# EAGLE design SNES USB-C (EAGLE 6.2)
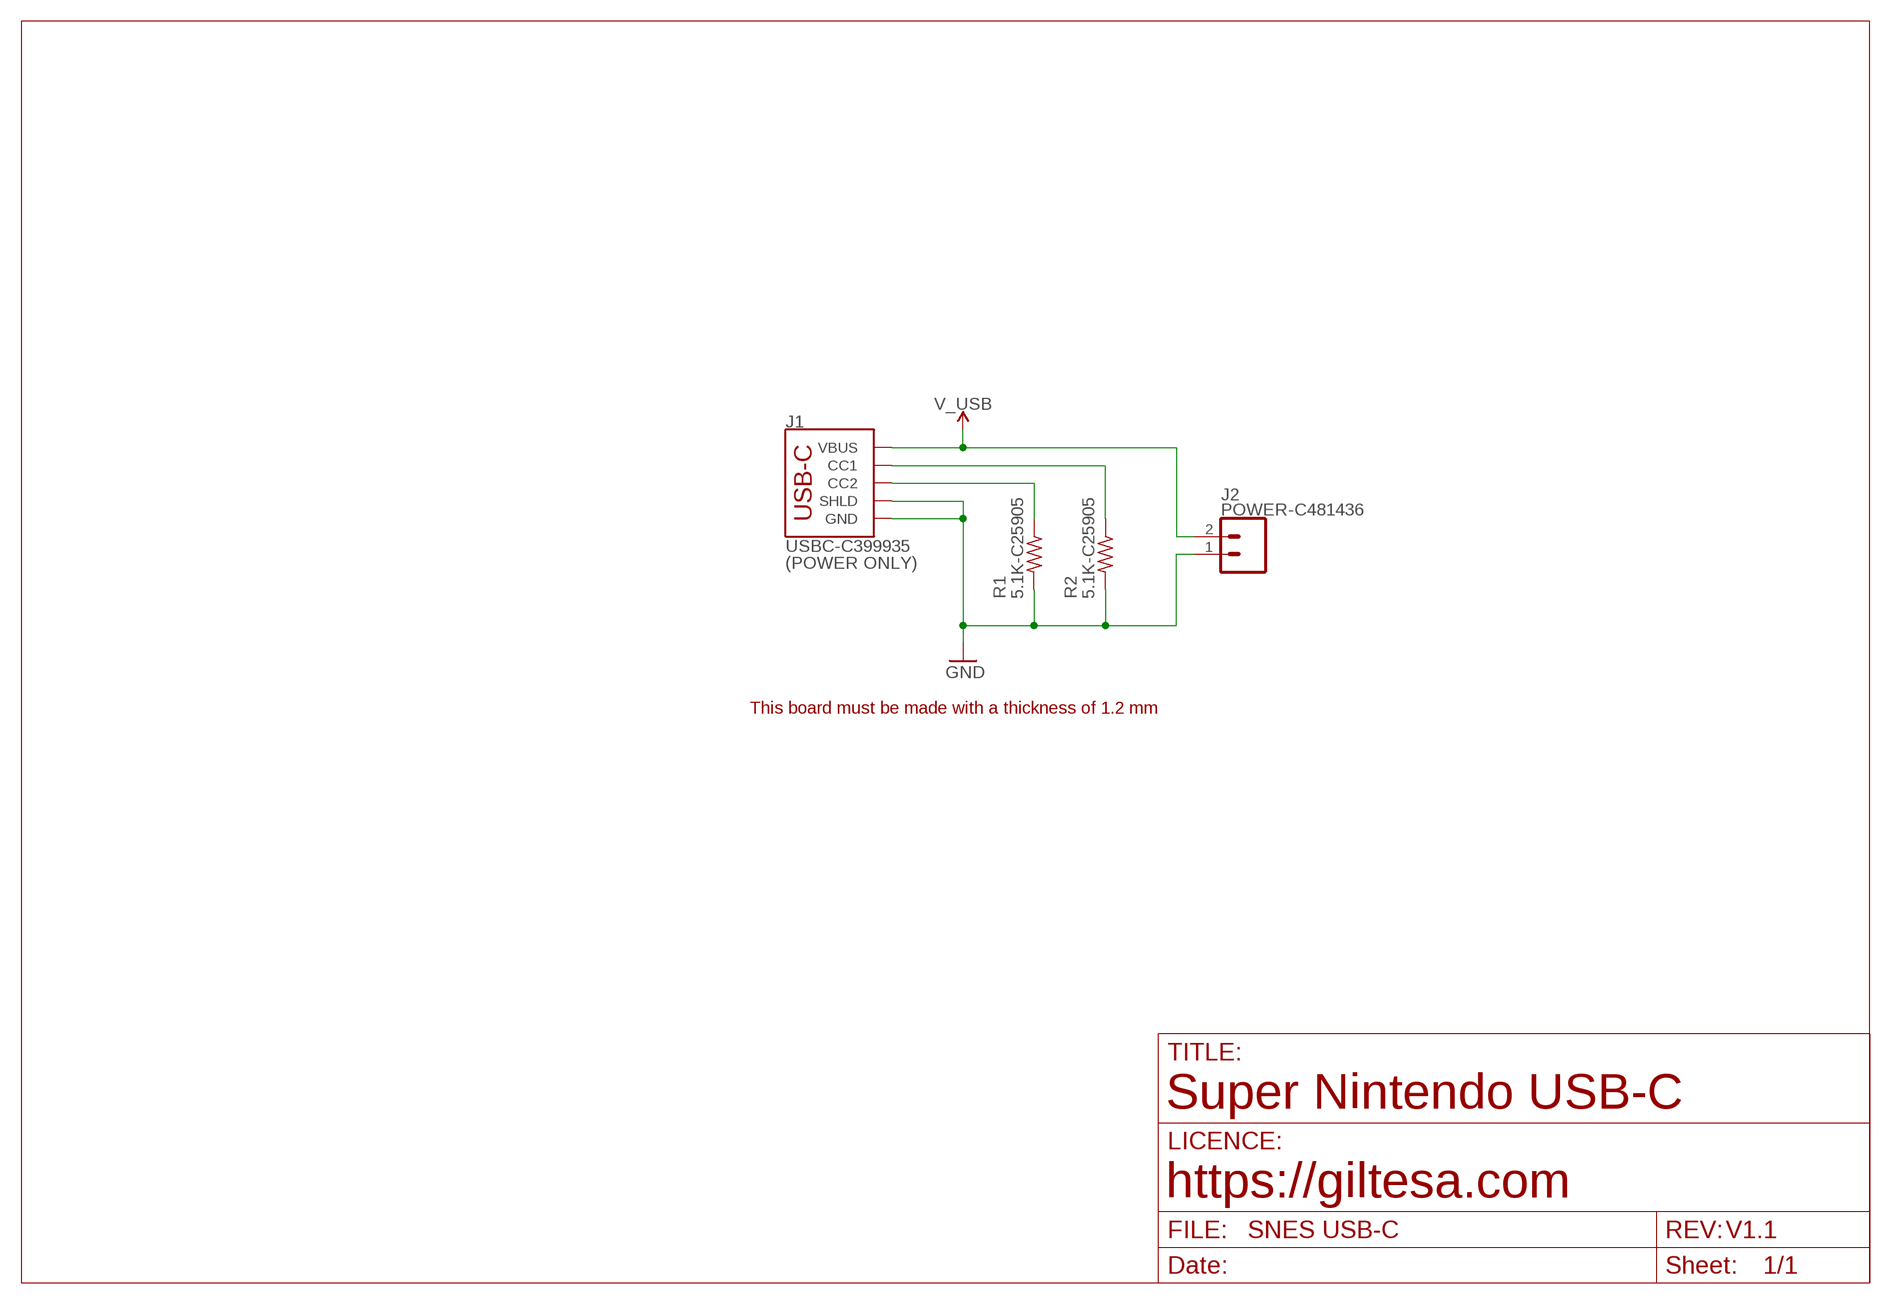
[diagram p0: schematic, sheet 1]

## Parts
J1  USBC-C399935  USB-C_6P_POWER_SIDE  [USB-C_6P_SIDE]
J2  POWER-C481436  JST-2_1.25MM  [JST-2-1.25MM_RIGHT]
R1  5.1K-C25905  R0402  [R0402]
R2  5.1K-C25905  R0402  [R0402]

## Nets
GND: J1.A12-GND(GND) J1.B12-GND(GND) J1.SHLD1(SHLD) J1.SHLD2(SHLD) J1.SHLD3(SHLD) J1.SHLD4(SHLD) J2.1 R1.2 R2.2
N$4: J1.B5(CC2) R1.1
N$13: J1.A5(CC1) R2.1
V_USB: J1.A9-VBUS(VBUS) J1.B9-VBUS(VBUS) J2.2

## Notes on the sheet
- (POWER ONLY)
- This board must be made with a thickness of 1.2 mm
- Super Nintendo USB-C
- https://giltesa.com
- V1.1

## Library data of the parts
J1 = ,giltesa:USB-C_6P
J2 = ,giltesa:JST-2
R1 R2 = ,giltesa:R0402

## Net classes
1 power: width 0.61 mm, drill 0.406 mm, clearance 0.203 mm
2 gnd: width 0.305 mm, drill 0.406 mm, clearance 0.203 mm
3 power usb: width 0.508 mm, drill 0.406 mm, clearance 0.203 mm

## Board
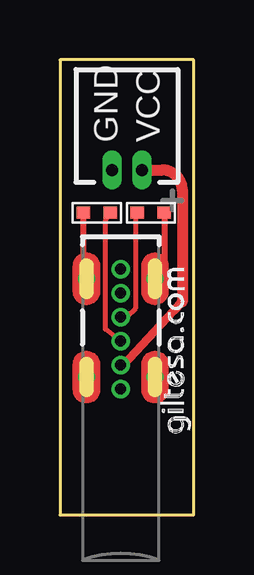
[diagram p1: board, top side]
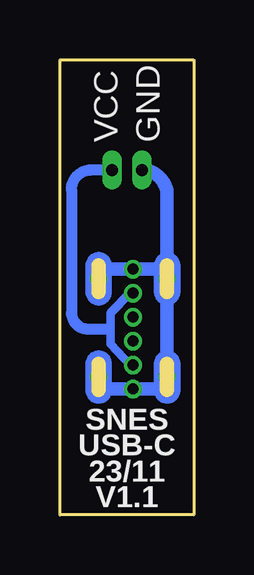
[diagram p2: board, bottom side, seen from below]

Size 5.59 x 18.97 mm. Coordinates in mm from the lower left corner, seen from the top.
Outline: 5.59,0 5.59,18.97 0,18.97 0,0 5.59,0
Copper layers (1*16): Top 0.035mm / dielectric 1.6mm / Bottom 0.035mm
Design rules: minimum track width 6mil, minimum drill 12mil, track to track 6mil, track to pad 6mil, pad to pad 6mil, via to via 8mil, smd to smd 0mil, copper to edge 20mil, drill to drill 10mil, minimum pad ring 6mil, minimum via ring 6mil, stop-mask expansion 0mil, vias tented up to drill 100mil, thermal gap 10mil

### Footprints (pad centres in the part's own frame; a part is rotated, then mirrored left to right if it is on the bottom)
USB-C_6P_SIDE = drill 0.457 pad 0.635: A5 0,-0.5; A9-VBUS 0,1.5; A12-GND 0,2.5; B5 0,0.5; B9-VBUS 0,-1.5; B12-GND 0,-2.5 | smd 0.127 x 0.127: SHLD0 -1.43,2.796 | drill 0.4 pad 0.6: SHLD1 -1.43,2.1; SHLD2 1.43,2.1; SHLD3 -1.43,-2; SHLD4 1.43,-2
JST-2-1.25MM_RIGHT = drill 0.5 long: 1 0.625,0; 2 -0.625,0 | smd 0.127 x 0.127: NA 0.625,-0.256
R0402 = smd 0.559 x 0.5: 1 -0.567,0; 2 0.567,0

### Placement (x,y rotation side)
J1  2.54,7.75 0 top
J2  2.79,14.38 180 top
R1  3.79,12.6 0 top
R2  1.54,12.6 180 top
U$11  [GILTESA.COM_MASK_7MM]  5.56,3.38 90 top

### Tracks (layer width: path | path; a pad name or v marks a point on that pad's centre or on a via)
GND
  Top 0.254: 4.47,12.6 R1.2 4.36,10.24 J1.SHLD2 | R2.2 0.97,9.98 J1.SHLD1
  Bottom 0.559: J1.SHLD4 3.97,5.25 J1.B12-GND 1.11,5.25 J1.SHLD3 J1.SHLD1 1.11,10.25 | J1.SHLD2 3.97,10.25 J1.A12-GND 1.11,10.25 | 1.11,10.25 1.11,13.32 arc-90 J2.1
N$4
  Top 0.203: J1.B5 2.79,8.25 3.17,8.64 3.17,12.42 R1.1
N$13
  Top 0.203: J1.A5 2.53,7.25 1.91,7.75 1.91,12.27 R2.1
V_USB
  Top 0.305: 2.56,6.22 2.64,6.22
  Top 0.356: 2.64,6.22 4.74,8.5 5.11,8.89 | J1.B9-VBUS 2.56,6.22
  Top 0.457: 5.11,8.89 5.11,13.56 arc90 4.29,14.38 J2.2
  Bottom 0.305: 2.56,6.22 2.64,6.22
  Bottom 0.356: J1.B9-VBUS 2.56,6.22 | J1.A9-VBUS 2.67,9.25 3.47,8.42 3.47,7.75 | 2.64,6.22 3.47,7.12 3.47,7.75 | 3.47,7.75 3.68,7.75
  Bottom 0.457: 3.68,7.75 4.4,7.75 arc90 5.11,8.43 5.11,13.56 arc90 4.29,14.38 J2.2

### Text on the board
tPlace: GND | VCC
bPlace: GND | VCC | SNES | USB-C | 23/11 | V1.1